# EAGLE design transimpedance_amplifier_soic8 (EAGLE 7.7.0)
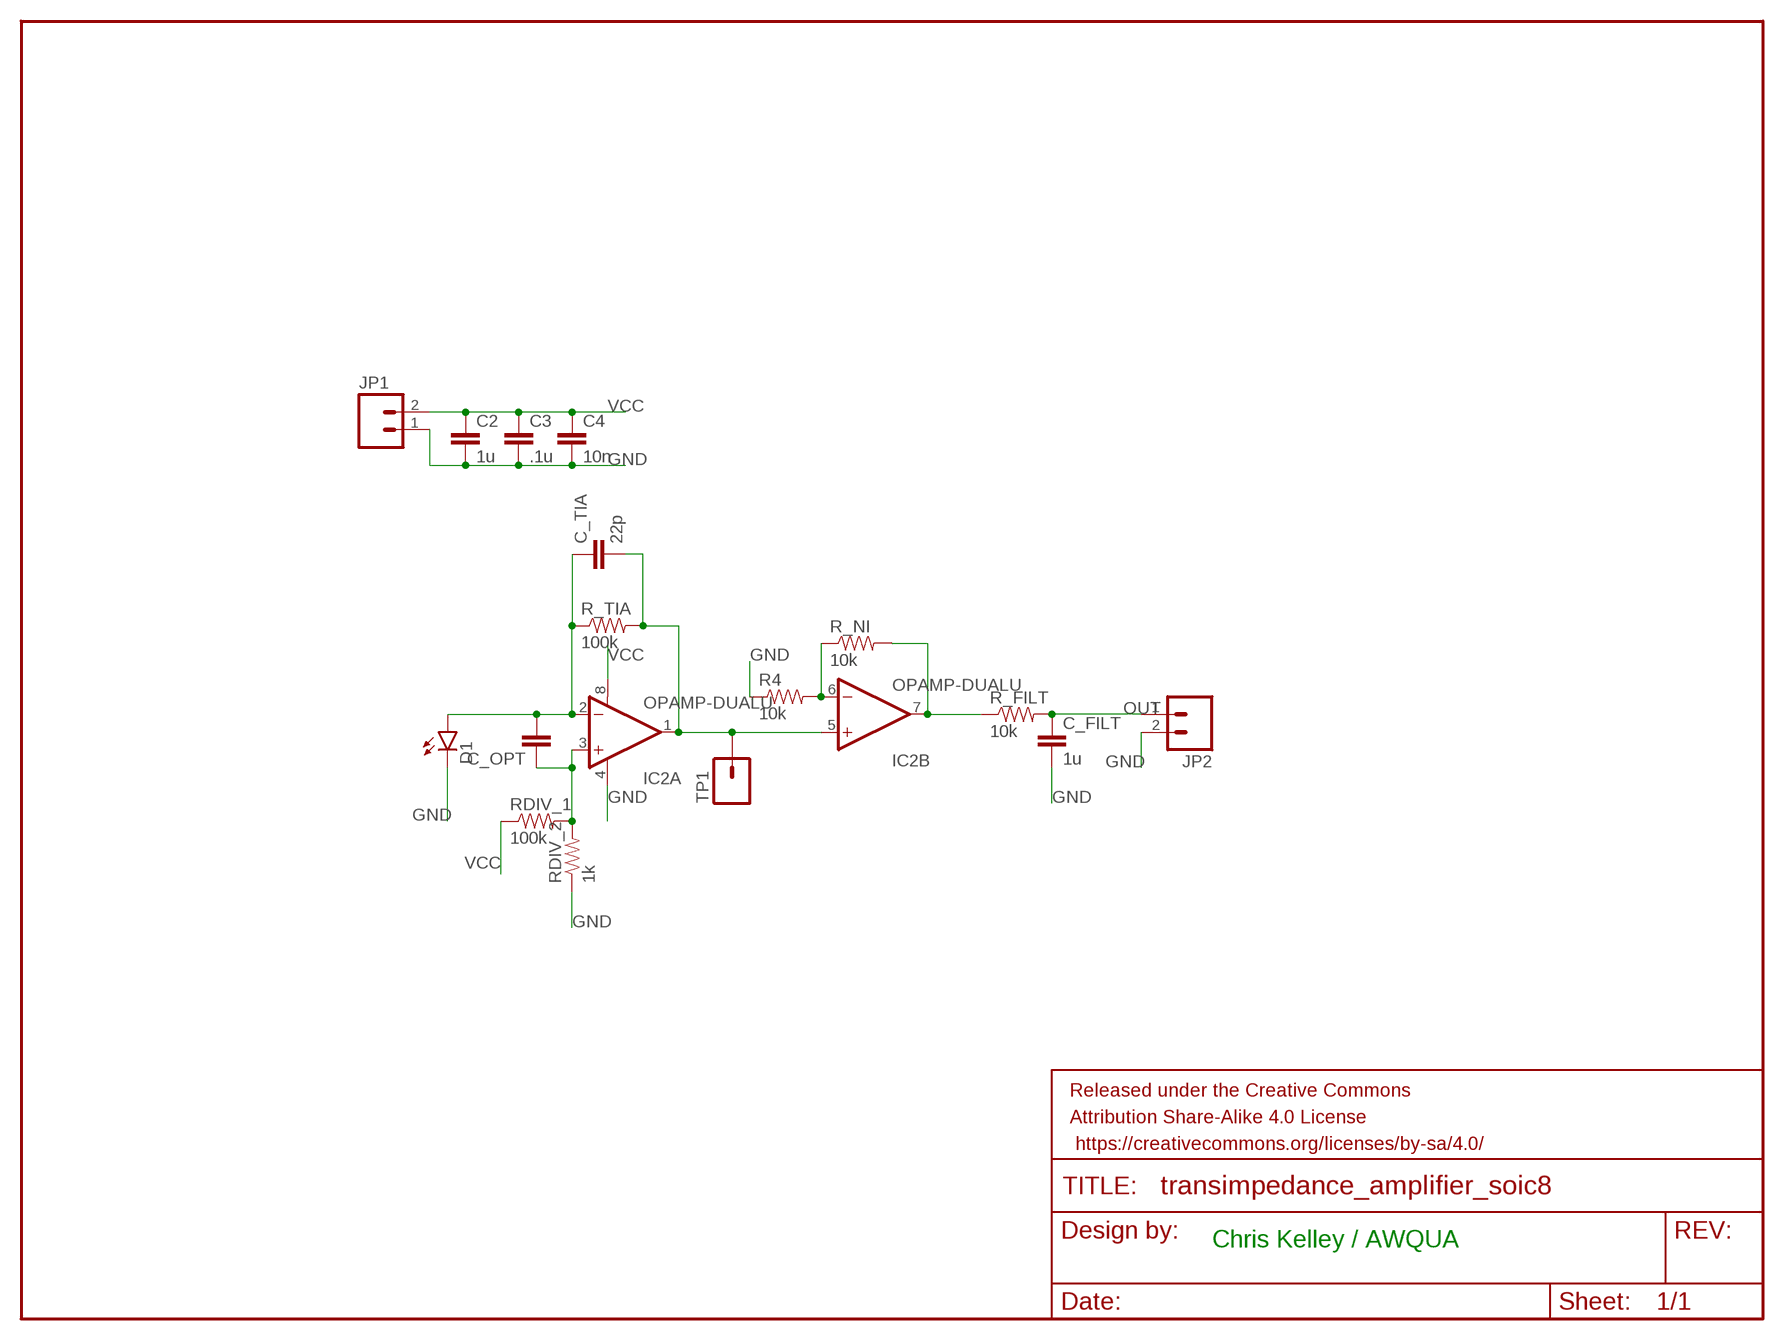
[diagram p0: schematic, sheet 1]

## Parts
C2  1u  CAP0805  [0805]
C3  .1u  CAP0805  [0805]
C4  10n  CAP0805  [0805]
C_FILT  1u  CAP0805  [0805]
C_OPT  CAP0805  [0805]
C_TIA  22p  CAP0805  [0805]
D1  LED5MM  [LED5MM]
FRAME1  FRAME-LETTER  [CREATIVE_COMMONS]
IC2  OPAMP-DUALU  [SO08]
JP1  M02PTH  [1X02]
JP2  M02PTH  [1X02]
R4  10k  RESISTOR0603-RES  [0603-RES]
R_FILT  10k  RESISTOR0603-RES  [0603-RES]
R_NI  10k  RESISTOR0603-RES  [0603-RES]
R_TIA  100k  RESISTOR0603-RES  [0603-RES]
RDIV_1  100k  RESISTOR0603-RES  [0603-RES]
RDIV_2  1k  RESISTOR0603-RES  [0603-RES]
TP1  M01PTH  [1X01]

## Nets
GND: C2.2 C3.2 C4.2 C_FILT.2 D1.K(C) IC2.4(A:V-) JP1.1 JP2.2 R4.1 RDIV_2.1
N$1: C_OPT.2 C_TIA.1 D1.A IC2.2(A:-IN) R_TIA.1
N$2: C_TIA.2 IC2.1(A:OUT) IC2.5(B:+IN) R_TIA.2 TP1.1
N$3: C_OPT.1 IC2.3(A:+IN) RDIV_1.2 RDIV_2.2
N$4: IC2.7(B:OUT) R_FILT.1 R_NI.2
N$5: IC2.6(B:-IN) R4.2 R_NI.1
OUT: C_FILT.1 JP2.1 R_FILT.2
VCC: C2.1 C3.1 C4.1 IC2.8(A:V+) JP1.2 RDIV_1.1

## Notes on the sheet
- Chris Kelley / AWQUA

## Library data of the parts
C2-C4 C_FILT C_OPT C_TIA = SparkFun-Passives:CAP: Capacitor Standard 0603 ceramic capacitor, and 0.1" leaded capacitor.
D1 = SparkFun-LED:LED: LEDs Standard schematic elements and footprints for 5mm, 3mm, 1206, and 0603 sized LEDs. 5mm - Spark Fun Electronics SKU : COM-00529 (and others)
FRAME1 = SparkFun-Aesthetics:FRAME-LETTER: Schematic Frame Standard 8.5x11 US Letter frame
IC2 = SparkFun-AnalogIC:OPAMP-DUAL: Generic op-amp footprint
JP1 JP2 = SparkFun-Connectors:M02: Standard 2-pin 0.1" header. Use with - straight break away headers ( PRT-00116) - right angle break away headers (PRT-00553) - swiss pins (PRT-00743) - machine pins (PRT-00117) - female headers (PRT-00115) Molex polarized connector foot print use with: PRT-08233 with associated crimp pins and housings. 2.54_SCREWTERM for use with PRT-10571. 3.5mm Screw Terminal footprints for PRT-08084 5mm Screw Terminal footprints for use with PRT-08432
R4 R_FILT R_NI R_TIA RDIV_1 RDIV_2 = SparkFun-Passives:RESISTOR: Resistor Basic schematic elements and footprints for 0603, 1206, and PTH resistors.
TP1 = SparkFun-Connectors:M01: Header 1 Standard 1-pin 0.1" header. Use with straight break away headers (SKU : PRT-00116), right angle break away headers (PRT-00553), swiss pins (PRT-00743), machine pins (PRT-00117), and female headers (PRT-00115).

## Board
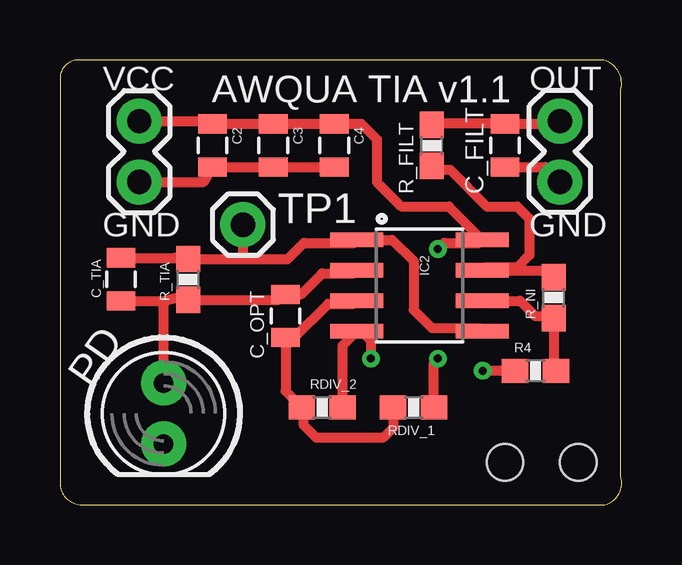
[diagram p1: board, top side]
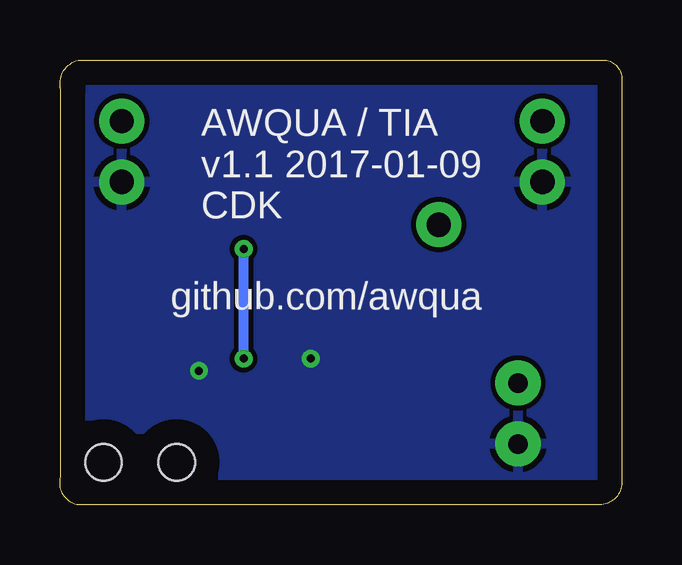
[diagram p2: board, bottom side, seen from below]

Size 23.4 x 18.55 mm. Coordinates in mm from the lower left corner, seen from the top.
Outline: 0,17.88 0,0.92 arc90 0.92,0 22.71,0 arc90 23.37,1.17 23.37,17.32 arc90 22.65,18.54 0.92,18.54 arc90 0,17.88
Copper layers (1*16): Top 0.035mm / dielectric 1.5mm / Bottom 0.035mm
Design rules "default *": minimum track width 10mil, minimum drill 24mil, track to track 8mil, track to pad 8mil, pad to pad 8mil, via to via 8mil, smd to smd 8mil, copper to edge 40mil, drill to drill 8mil, minimum pad ring 10mil, minimum via ring 8mil, stop-mask expansion 4mil, vias tented up to drill 13mil, thermal gap 10mil
Holes 1.52 mm at 21.59,1.78 18.54,1.78

### Footprints (pad centres in the part's own frame; a part is rotated, then mirrored left to right if it is on the bottom)
0805 = smd 0.8 x 1.2: 1 -0.9,0; 2 0.9,0
LED5MM = drill 0.813 pad 1.88: A -1.27,0; K 1.27,0
SO08 = smd 0.61 x 2.21: 1 -1.905,-2.616; 2 -0.635,-2.616; 3 0.635,-2.616; 4 1.905,-2.616; 5 1.905,2.616; 6 0.635,2.616; 7 -0.635,2.616; 8 -1.905,2.616
1X02 = drill 1.016 pad 1.88: 1 0,0; 2 2.54,0
0603-RES = smd 1.1 x 1: 1 -0.85,0; 2 0.85,0
1X01 = drill 1.016 pad 1.88: 1 0,0

### Placement (x,y rotation side)
C2  6.35,14.99 270 top
C3  8.89,14.99 270 top
C4  11.43,14.99 270 top
C_FILT  18.54,14.99 270 top
C_OPT  9.4,7.87 90 top
C_TIA  2.54,9.4 90 top
D1  4.32,3.81 270 top
FRAME1  16.51,-15.24 0 top  (outside the outline)
IC2  14.99,9.14 270 top
JP1  3.3,13.46 90 top
JP2  20.83,16 270 top
R4  19.81,5.59 0 top
R_FILT  15.49,14.99 90 top
R_NI  20.57,8.64 90 top
R_TIA  5.33,9.4 90 top
RDIV_1  14.73,4.06 180 top
RDIV_2  10.92,4.06 180 top
TP1  7.62,11.68 0 top

### Tracks (layer width: path | path; a pad name or v marks a point on that pad's centre or on a via)
GND  (via drill 0.33)
  Top 0.406: JP1.1 5.98,13.46 C2.2 C3.2 C4.2 | RDIV_2.1 11.77,6.64 IC2.4 12.57,7.24 12.95,6.86 v12.95,6.1 | C_FILT.2 20.2,14.09 JP2.2 | R4.1 v17.61,5.59
  pour Bottom: -2.54,20.07 26.16,20.32 26.16,-2.03 -2.54,-2.29
N$1
  Top 0.406: C_TIA.1 4.32,8.5 | 4.32,8.5 5.28,8.75 R_TIA.1 9.12,8.55 C_OPT.2 10.04,8.77 10.92,9.65 12.24,9.65 IC2.2 | D1.A 4.32,8.5
N$2
  Top 0.406: C_TIA.2 4.78,10.3 R_TIA.2 7.62,10.25 | 7.62,10.25 9.49,10.25 10.16,10.92 12.24,10.92 IC2.1 13.84,11.05 14.73,10.16 14.73,8.13 15.49,7.37 17.48,7.37 IC2.5 | TP1.1 7.62,10.25
N$3
  Top 0.406: IC2.3 12.24,8.38 11.18,8.38 9.77,6.97 C_OPT.1 9.4,4.74 RDIV_2.2 10.16,3.98 10.16,3.3 10.67,2.79 13.46,2.79 13.88,3.21 RDIV_1.2
N$4
  Top 0.406: 15.49,14.22 R_FILT.1 15.49,13.97 16.26,13.97 17.78,12.45 19.05,12.45 19.56,11.94 19.56,10.41 19.05,9.91 17.73,9.91 IC2.7 20.28,9.78 R_NI.2
N$5
  Top 0.406: IC2.6 19.18,8.51 19.81,7.87 20.49,7.87 R_NI.1 20.57,5.59 R4.2
OUT
  Top 0.406: JP2.1 20.71,15.89 C_FILT.1 15.49,15.89 R_FILT.2 15.49,15.75
VCC  (via drill 0.33)
  Top 0.406: JP1.2 5.98,16 C2.1 C3.1 C4.1 12.56,15.89 13.21,15.24 13.21,13.46 14.22,12.45 16.2,12.45 IC2.8 17.48,10.92 16,10.92 v15.75,10.67 | RDIV_1.1 15.58,5.93 v15.75,6.1
  Bottom 0.406: v15.75,6.1 v15.75,10.67

### Text on the board
tPlace: VCC | AWQUA TIA v1.1 | OUT | GND | GND | PD | Chris Kelley / AWQUA
bPlace: AWQUA / TIA / v1.1 2017-01-09 / CDK | github.com/awqua